# Altium schematic sheet 遥控器.SchDoc
size A4
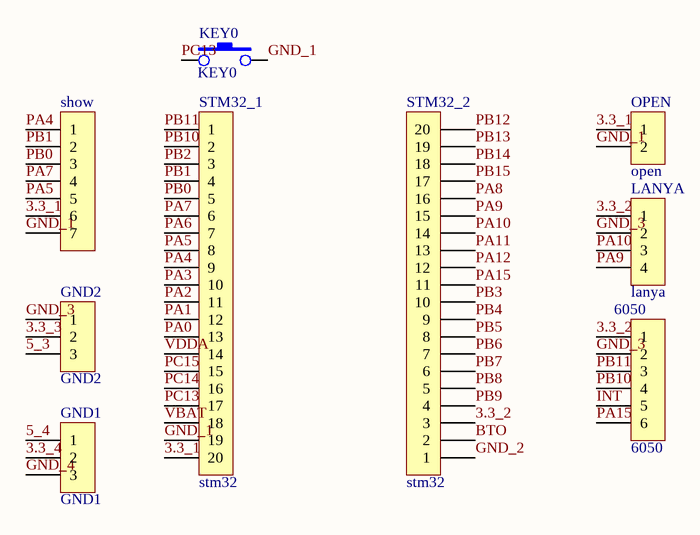
[diagram p0: 遥控器.SchDoc]

## Parts
6050  6050  [Fe-HDR1X6/2.54-S]
GND1  GND1  [Fe-HDR1X3/2.54-S]
GND2  GND2  [Fe-HDR1X3/2.54-S]
KEY0  KEY0  [DIP-6X6X10]
LANYA  lanya  [Fe-HDR1X4/2.54-S]
OPEN  open  [Pin HDR1X2/2.54mm-S]
show  (no value)  [Fe-HDR1X7/2.54-S]
STM32_1  stm32  [Fe-HDR1X20/2.54-S]
STM32_2  stm32  [Fe-HDR1X20/2.54-S]

## Nets
3.3_1: OPEN.1 show.6 STM32_1.20
3.3_2: 6050.1 LANYA.1 STM32_2.3
3.3_3: GND2.2
3.3_4: GND1.2
5_3: GND2.3
5_4: GND1.1
BTO: STM32_2.2
GND_1: KEY0.3 OPEN.2 show.7 STM32_1.19
GND_2: STM32_2.1
GND_3: 6050.2 GND2.1 LANYA.2
GND_4: GND1.3
INT: 6050.5
PA0: STM32_1.13
PA1: STM32_1.12
PA2: STM32_1.11
PA3: STM32_1.10
PA4: show.1 STM32_1.9
PA5: show.5 STM32_1.8
PA6: STM32_1.7
PA7: show.4 STM32_1.6
PA8: STM32_2.16
PA9: LANYA.4 STM32_2.15
PA10: LANYA.3 STM32_2.14
PA11: STM32_2.13
PA12: STM32_2.12
PA15: 6050.6 STM32_2.11
PB0: show.3 STM32_1.5
PB1: show.2 STM32_1.4
PB2: STM32_1.3
PB3: STM32_2.10
PB4: STM32_2.9
PB5: STM32_2.8
PB6: STM32_2.7
PB7: STM32_2.6
PB8: STM32_2.5
PB9: STM32_2.4
PB10: 6050.4 STM32_1.2
PB11: 6050.3 STM32_1.1
PB12: STM32_2.20
PB13: STM32_2.19
PB14: STM32_2.18
PB15: STM32_2.17
PC13: KEY0.1 STM32_1.17
PC14: STM32_1.16
PC15: STM32_1.15
VBAT: STM32_1.18
VDDA: STM32_1.14

## Library data of the parts
6050 = Female HDR1X6
GND1 GND2 = Female HDR1X3
KEY0 = KEY
LANYA = Female HDR1X4
OPEN = Pin HDR1X2
show = Female HDR1X7
STM32_1 STM32_2 = Female HDR1X20